# Altium schematic sheet UTM53.schdoc
size 309 x 223 mm; Symbol: Sheet-Symbol_A4; Device: Sheet-Symbol_A4; Company: EasyEDA.com; Drawed: EasyEDA Pro; Reviewed: EasyEDA Pro; Version: V0.1; Page Size: A4; @Project Name: UTMMini; @Page Count: 1; @Update Date: 2022-12-12; @Create Date: 2022-12-05; @Schematic Name: UTM53_1; Part Number: JLCPCB-002; @Page No: 1; @Page Name: P1
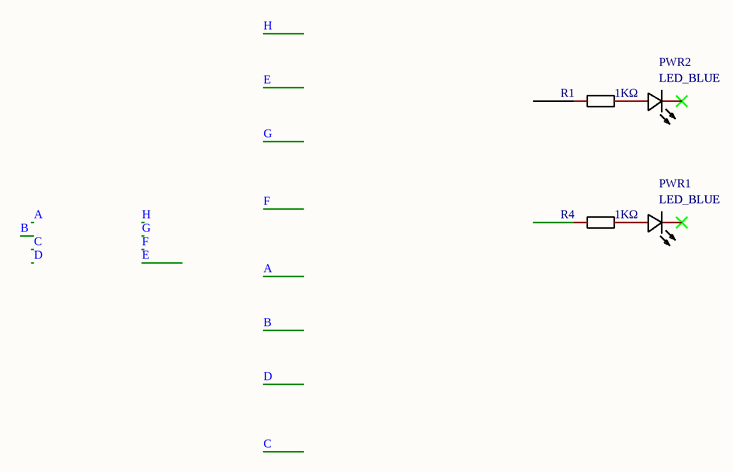
[diagram p0: UTM53.schdoc]

## Parts
PWR1  LED_BLUE  [LED0805-RD]
PWR2  LED_BLUE  [LED0805-RD]
R1  LCSC Part Name: 1KΩ  [R0603]  (hidden comment: 0603WAF1001T5E)
R4  LCSC Part Name: 1KΩ  [R0603]  (hidden comment: 0603WAF1001T5E)

## Nets
NetPWR1_2: PWR1.2(+) R4.2
NetPWR2_2: PWR2.2(+) R1.2

Not connected (* = marked no-connect by the designer): PWR1 1(-)*; PWR2 1(-)*; R1 1; R4 1

## Notes on the sheet
- 1
- 2
- 3
- 4
- 5
- 6
- A
- B
- C
- Schematic
- UTM53_1
- Create Date
- Update Date
- 2022-12-12
- 2022-12-05
- Reviewed
- Drawed
- Page
- EasyEDA Pro
- P1
- Part Number
- UTMMini
- JLCPCB-002
- D
- VER
- SIZE
- PAGE
- OF
- V0.1
- A4
- EasyEDA.com

## Library data of the parts
PWR1 PWR2 = NCD0805B2: Emitted Color:blue; Manufacturer: 国星光电; Symbol: FC-A2012BK-470H2; Add into BOM: yes; Emitted Color: blue; Name: LED_BLUE; Device: NCD0805B2; LCSC Part Name: 蓝灯; Supplier Part: C84259; Manufacturer Part: NCD0805B2; Supplier Footprint: 0805; JLCPCB Part Class: 扩展库; Datasheet: https://atta.szlcsc.com/upload/public/pdf/source/20200820/C84259_E5AC6865415989C4C2C2831134BA3A23.pdf; Supplier: LCSC; Convert to PCB: yes
R1 R4 = 0603WAF1001T5E: Manufacturer: UNI-ROYAL(厚声); Add into BOM: yes; Name: 0603WAF1001T5E; Symbol: 0603WAF1001T5E; Device: 0603WAF1001T5E; Supplier Part: C21190; Manufacturer Part: 0603WAF1001T5E; Supplier Footprint: 0603; JLCPCB Part Class: 基础库; Datasheet: https://atta.szlcsc.com/upload/public/pdf/source/20170920/C21190_1505887441885980538.pdf; Supplier: LCSC; Convert to PCB: yes